# Altium schematic sheet headers.SchDoc
size A; SheetNumber: 2; SheetTotal: 3
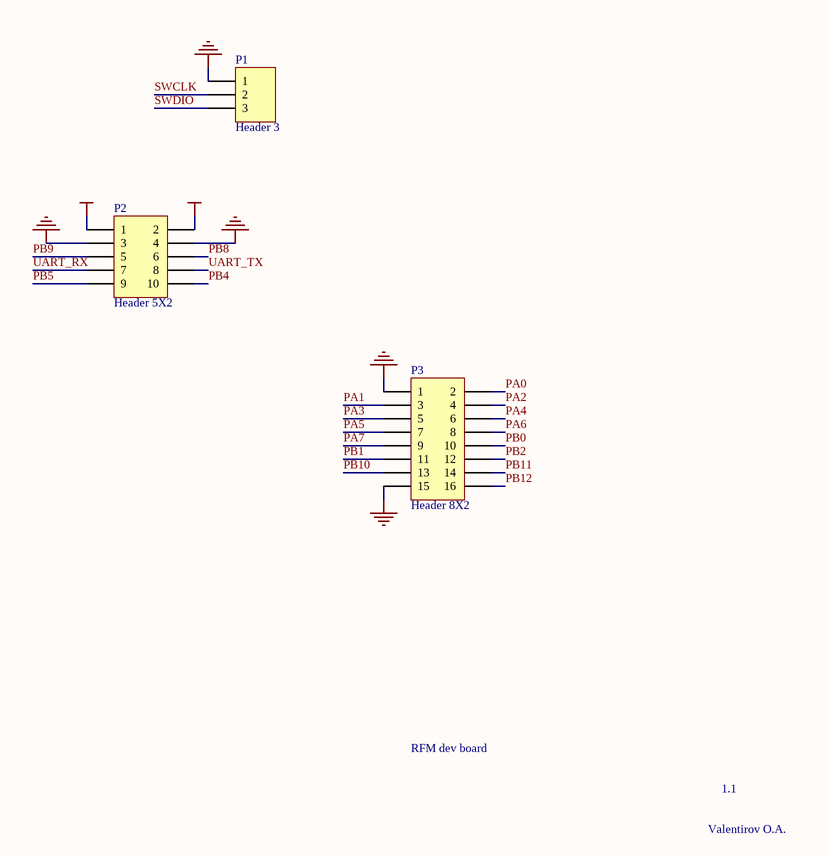
[diagram p0: headers.SchDoc]

## Parts
P1  Header 3  [HDR1X3]
P2  Header 5X2  [HDR2X5]
P3  Header 8X2  [HDR2X8]

## Nets
GND: P1.1 P2.3 P2.4 P3.1 P3.15
VCC: P2.1 P2.2
PA0: P3.2
PA1: P3.3
PA2: P3.4
PA3: P3.5
PA4: P3.6
PA5: P3.7
PA6: P3.8
PA7: P3.9
PB0: P3.10
PB1: P3.11
PB2: P3.12
PB4: P2.10
PB5: P2.9
PB8: P2.6
PB9: P2.5
PB10: P3.13
PB11: P3.14
PB12: P3.16
SWCLK: P1.2
SWDIO: P1.3
UART_RX: P2.7
UART_TX: P2.8

## Notes on the sheet
- RFM dev board
- 1.1
- Valentirov O.A.

## Library data of the parts
P1 = Header 3: Header, 3-Pin; LatestRevisionDate: 17-Jul-2002; LatestRevisionNote: Re-released for DXP Platform.; Publisher: Altium Limited
P2 = Header 5X2: Header, 5-Pin, Dual row; LatestRevisionDate: 17-Jul-2002; LatestRevisionNote: Re-released for DXP Platform.; Publisher: Altium Limited
P3 = Header 8X2: Header, 8-Pin, Dual row; LatestRevisionDate: 17-Jul-2002; LatestRevisionNote: Re-released for DXP Platform.; Publisher: Altium Limited